# EAGLE design s2k_vr (EAGLE 7.6.0)
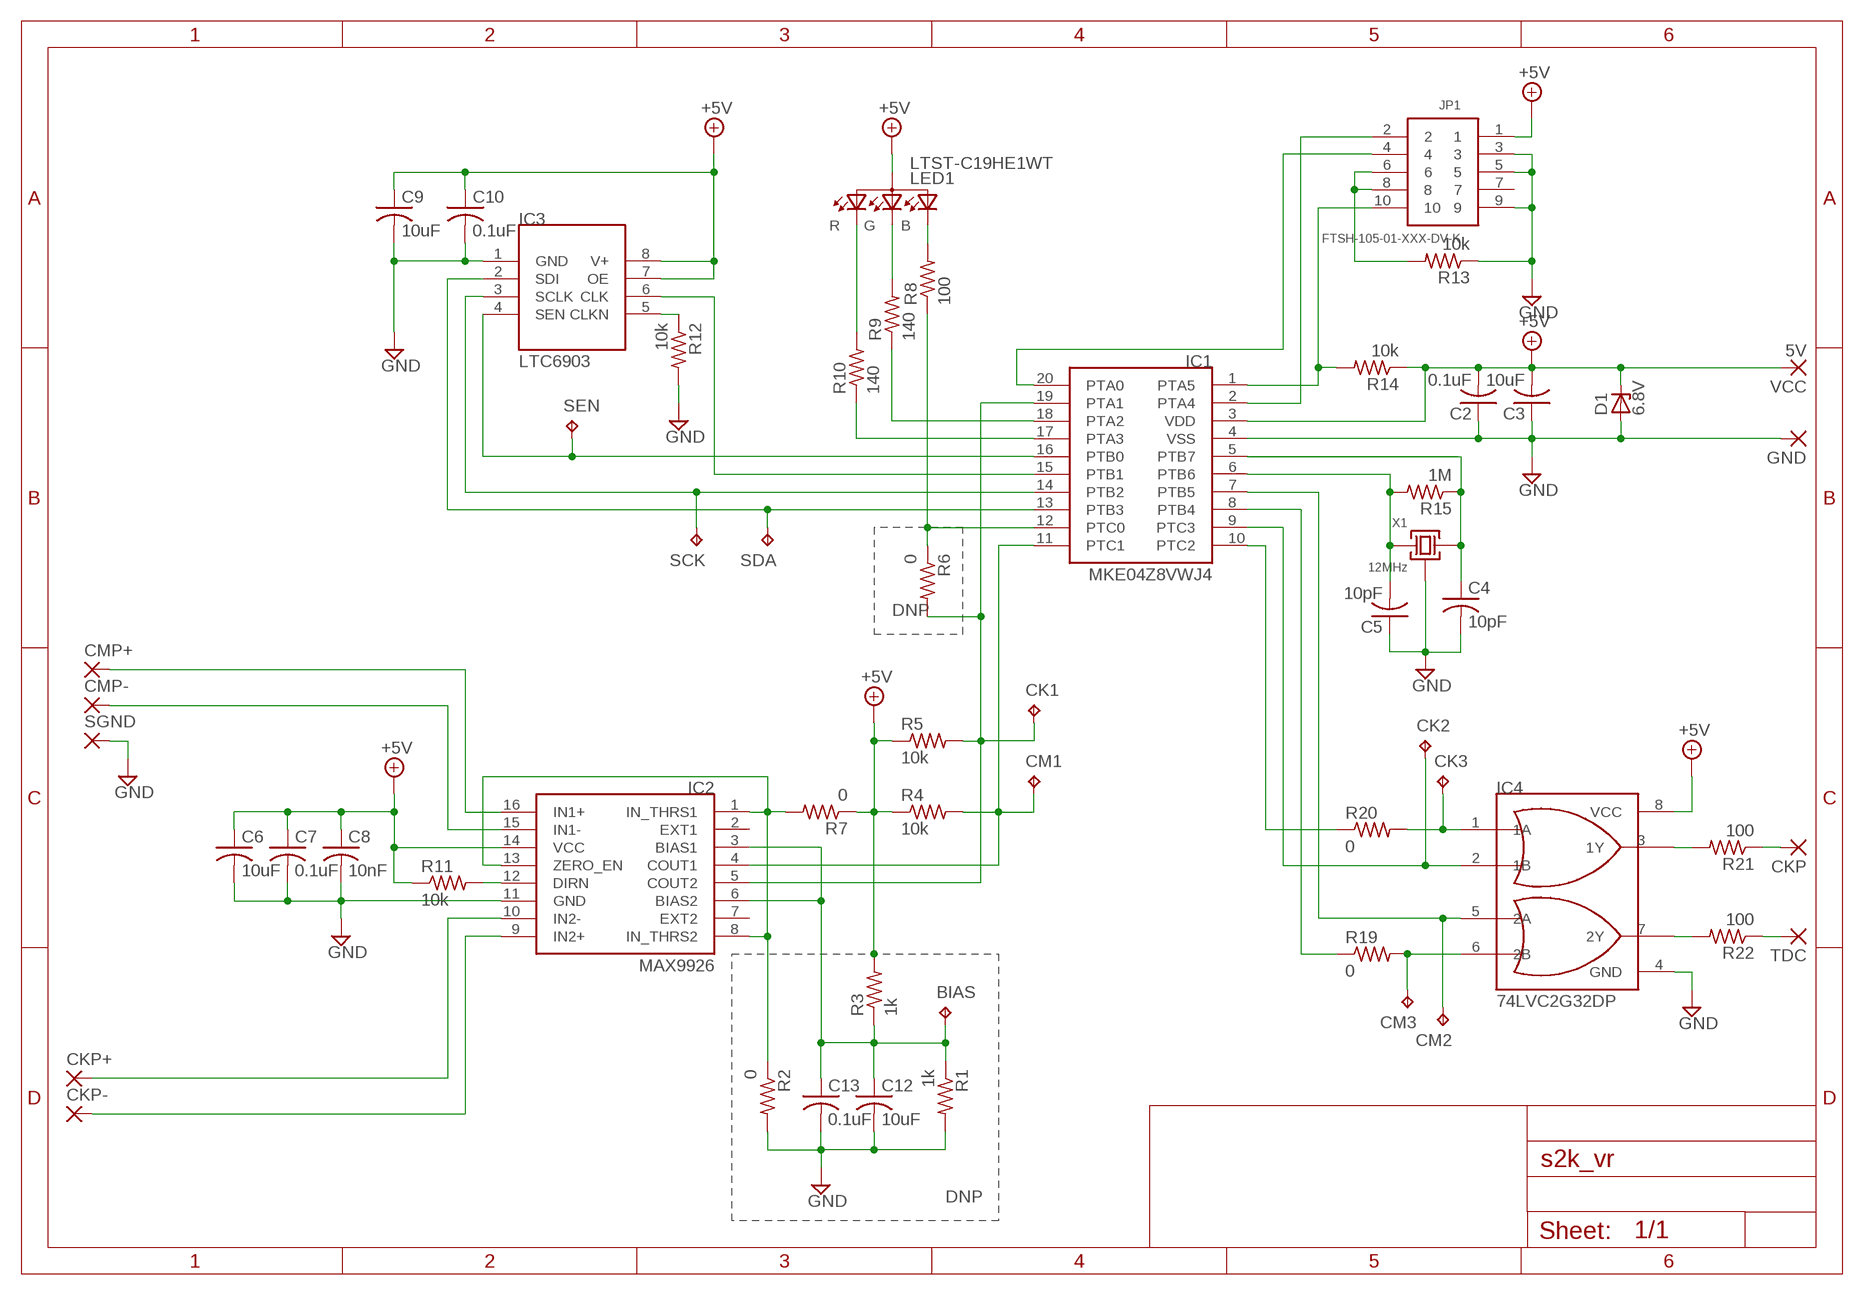
[diagram p0: schematic, sheet 1]

## Parts
BIAS  TPB2,54  [B2,54]
C2  0.1uF  C-USC0603  [C0603]
C3  10uF  C-USC0805  [C0805]
C4  10pF  C-USC0603  [C0603]
C5  10pF  C-USC0603  [C0603]
C6  10uF  C-USC0805  [C0805]
C7  0.1uF  C-USC0603  [C0603]
C8  10nF  CAP-0306  [C0306]
C9  10uF  C-USC0805  [C0805]
C10  0.1uF  C-USC0603  [C0603]
C12  10uF  C-USC0603  [C0603]
C13  0.1uF  C-USC0603  [C0603]
CK1  TPB2,54  [B2,54]
CK2  TPB2,54  [B2,54]
CK3  TPB2,54  [B2,54]
CKP  3,81/1,4  [3,81/1,4]
CKP+  3,81/1,4  [3,81/1,4]
CKP-  3,81/1,4  [3,81/1,4]
CM1  TPB2,54  [B2,54]
CM2  TPB2,54  [B2,54]
CM3  TPB2,54  [B2,54]
CMP+  3,81/1,4  [3,81/1,4]
CMP-  3,81/1,4  [3,81/1,4]
D1  6.8V  ZENER-DIODESOT23  [SOT23]
GND  3,81/1,4  [3,81/1,4]
IC1  MKE04Z8VWJ4  [SOIC20S]
IC2  MAX9926  [16-QSOP]
IC3  LTC6903  [MS8]
IC4  74LVC2G32DP  [TSSOP8]
JP1  FTSH-105-01-XXX-DV-K  [FTSH-105-01-XXX-DV-K]
LED1  LTST-C19HE1WT  [LED-0606]
R1  1k  R-US_R0603  [R0603]
R2  0  R-US_R0603  [R0603]
R3  1k  R-US_R0603  [R0603]
R4  10k  R-US_R0603  [R0603]
R5  10k  R-US_R0603  [R0603]
R6  0  R-US_R0603  [R0603]
R7  0  R-US_R0603  [R0603]
R8  100  R-US_R0603  [R0603]
R9  140  R-US_R0603  [R0603]
R10  140  R-US_R0603  [R0603]
R11  10k  R-US_R0603  [R0603]
R12  10k  R-US_R0603  [R0603]
R13  10k  R-US_R0603  [R0603]
R14  10k  R-US_R0603  [R0603]
R15  1M  R-US_R0603  [R0603]
R19  0  R-US_R0603  [R0603]
R20  0  R-US_R0603  [R0603]
R21  100  R-US_R0603  [R0603]
R22  100  R-US_R0603  [R0603]
SCK  TPB2,54  [B2,54]
SDA  TPB2,54  [B2,54]
SEN  TPB2,54  [B2,54]
SGND  3,81/1,4  [3,81/1,4]
TDC  3,81/1,4  [3,81/1,4]
VCC  5V  3,81/1,4  [3,81/1,4]
X1  12MHz  CX2520DB  [SMD4-2520]

## Nets
+5V: C2.2 C3.2 C6.1 C7.1 C8.1 C9.1 C10.1 D1.3(C) IC1.3(VDD) IC2.14(VCC) IC3.7(OE) IC3.8(V+) IC4.8(VCC) JP1.1 LED1.4(ANODE) R3.2 R4.1 R5.1 R7.1 R11.1 R14.1 VCC.1(P)
CAM_EDGE: CM1.TP IC1.11(PTC1) IC2.4(COUT1) R4.2
CAM_IN+: CKP+.1(P) IC2.10(IN2-)
CAM_IN-: CKP-.1(P) IC2.9(IN2+)
CAM_OUT: R22.1 TDC.1(P)
CAM_PULSE: CK2.TP IC1.9(PTC3) IC4.2(1B)
CAM_TDC: CK3.TP IC4.1(1A) R20.2
CLK: IC1.15(PTB1) IC3.6(CLK)
CRANK_EDGE: CK1.TP IC1.19(PTA1) IC2.5(COUT2) R5.2 R6.2
CRANK_IN+: CMP+.1(P) IC2.16(IN1+)
CRANK_IN-: CMP-.1(P) IC2.15(IN1-)
CRANK_OUT: CKP.1(P) R21.1
CRANK_PULSE: CM2.TP IC1.7(PTB5) IC4.5(2A)
GND: C2.1 C3.1 C4.2 C5.1 C6.2 C7.2 C8.2 C9.2 C10.2 C12.2 C13.2 D1.1(A) GND.1(P) IC1.4(VSS) IC2.11(GND) IC3.1(GND) IC4.4(GND) JP1.3 JP1.5 JP1.9 R1.2 R2.2 R12.2 R13.1 SGND.1(P) X1.2(GND) X1.4(GND)
MOSI: IC1.13(PTB3) IC3.2(SDI) SDA.TP
N$5: IC2.12(DIRN) R11.2
N$6: IC1.18(PTA2) R9.1
N$9: LED1.3(B) R8.2
N$10: C4.1 IC1.5(PTB7) R15.1 X1.1
N$12: IC1.17(PTA3) R10.1
N$13: IC3.5(CLKN) R12.1
N$14: IC1.12(PTC0) R6.1 R8.1
N$15: IC1.8(PTB4) R19.1
N$17: IC1.10(PTC2) R20.1
N$19: BIAS.TP C12.1 C13.1 IC2.3(BIAS1) IC2.6(BIAS2) R1.1 R3.1
N$20: LED1.2(G) R9.2
N$21: IC4.3(1Y) R21.2
N$22: LED1.1(R) R10.2
N$24: JP1.6 JP1.8 R13.2
N$25: CM3.TP IC4.6(2B) R19.2
N$26: C5.2 IC1.6(PTB6) R15.2 X1.3
N$36: IC2.1(IN_THRS1) IC2.8(IN_THRS2) IC2.13(ZERO_EN) R2.1 R7.2
N$39: IC4.7(2Y) R22.2
NRST: IC1.1(PTA5) JP1.10 R14.2
SPICK: IC1.14(PTB2) IC3.3(SCLK) SCK.TP
SPIEN: IC1.16(PTB0) IC3.4(SEN) SEN.TP
SWCLK: IC1.20(PTA0) JP1.4
SWDIO: IC1.2(PTA4) JP1.2
Unconnected: IC2.2(EXT1) IC2.7(EXT2) JP1.7

## Notes on the sheet
- DNP
- DNP

## Library data of the parts
BIAS CK1-CK3 CM1-CM3 SCK SDA SEN = testpad:TP: Test pad
C2-C7 C9 C10 = resistor:C-US: CAPACITOR, American symbol
C8 = parts:CAP-0306
C12 C13 = resistor:C-US: CAPACITOR, American symbol; DNP: DNP
CKP CKP+ CKP- CMP+ CMP- GND SGND TDC VCC = wirepad:3,81/1,4: THROUGH-HOLE PAD
D1 = diode:ZENER-DIODE: Z-Diode
IC1 = parts:MKE04Z8VWJ4
IC2 = parts:MAX9926
IC3 = parts:LTC6903
IC4 = parts:74LVC2G32DP
JP1 = FTSH-105-XX-XX-DV-K:FTSH-105-01-XXX-DV-K
LED1 = parts:LTST-C19HE1WT
R1-R3 R6 = resistor:R-US_: RESISTOR, American symbol; DNP: DNP
R4 R5 R7-R15 R19-R22 = resistor:R-US_: RESISTOR, American symbol
X1 = parts:CX2520DB

## Board
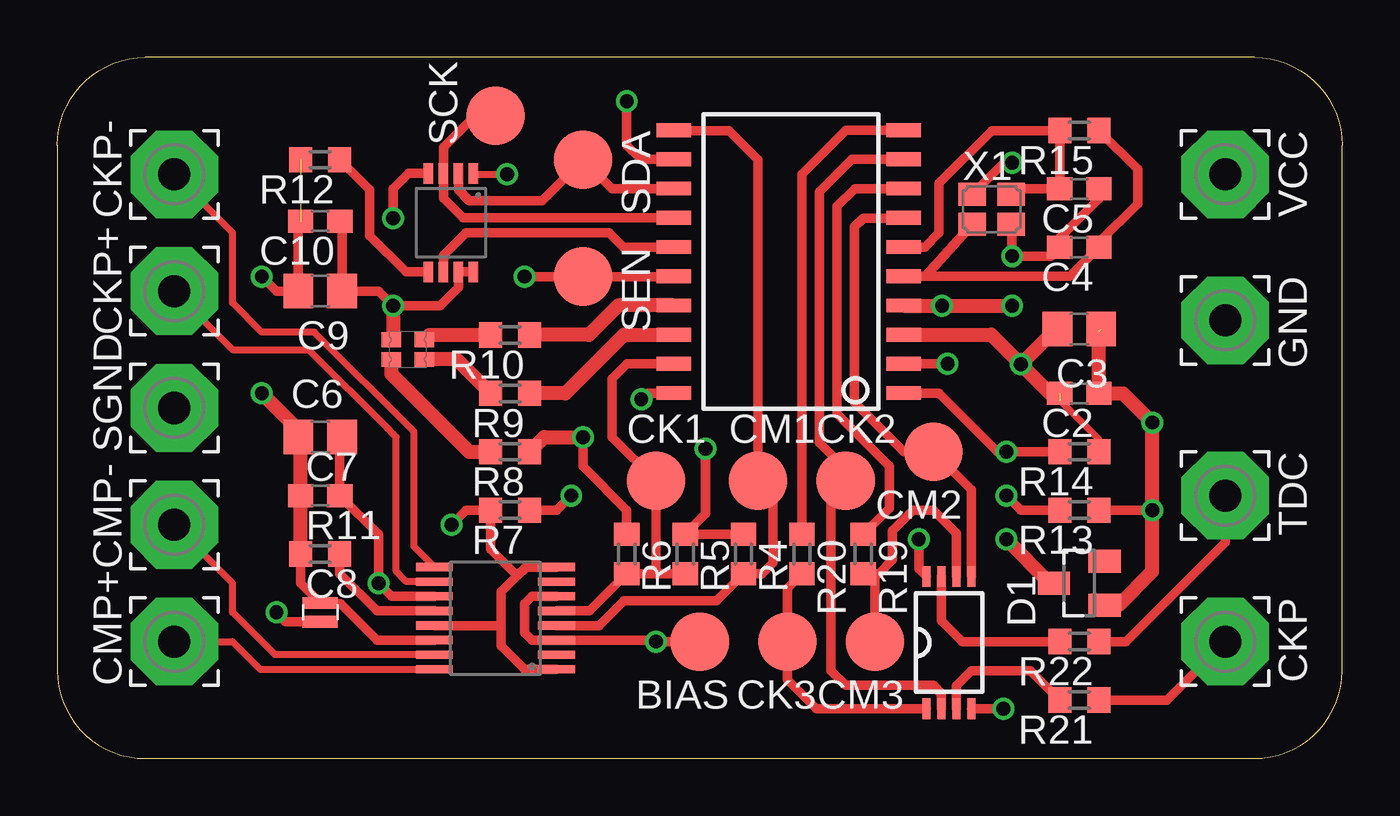
[diagram p1: board, top side]
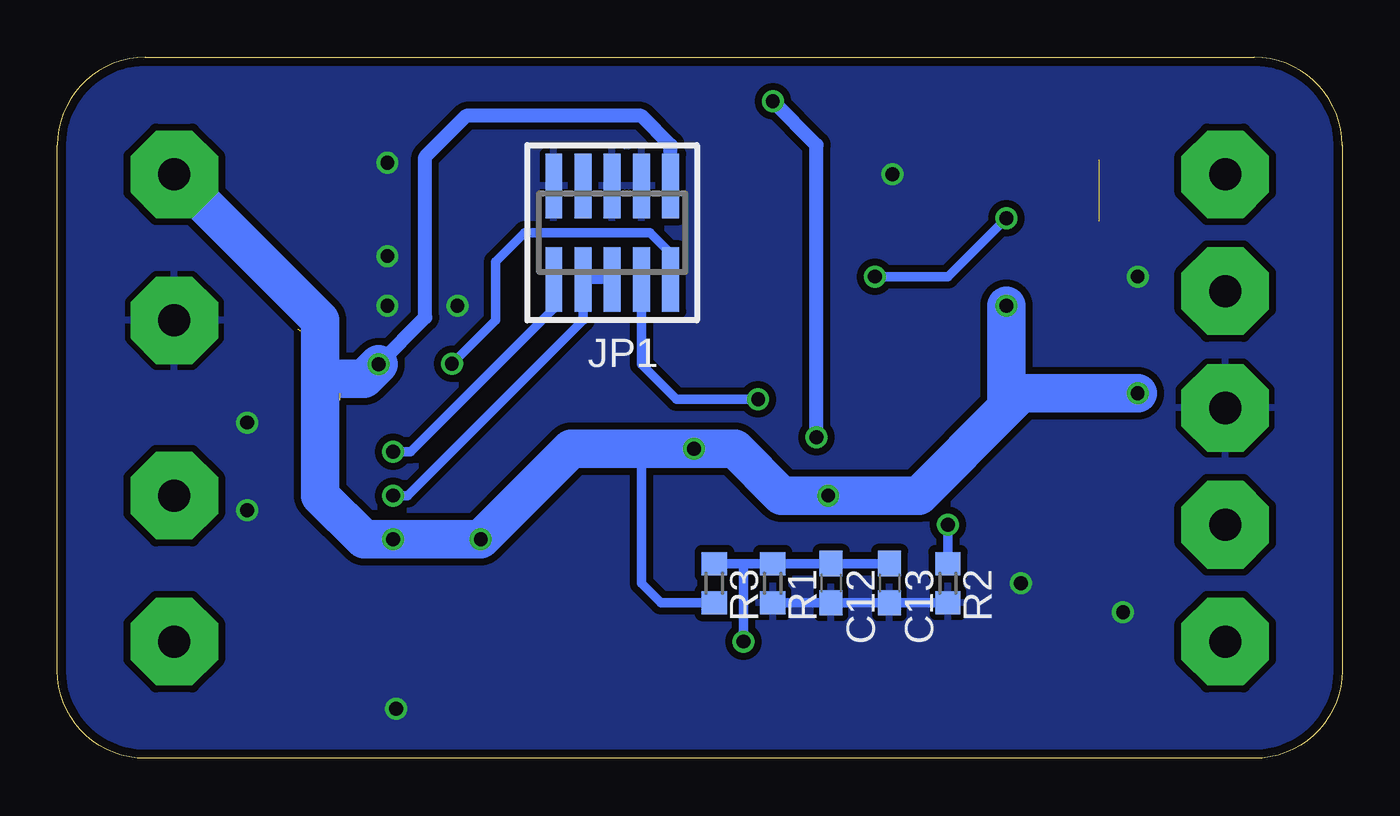
[diagram p2: board, bottom side, seen from below]

Size 55.88 x 30.48 mm. Coordinates in mm from the lower left corner, seen from the top.
Outline: 3.81,0 52.07,0 arc90 55.88,3.81 55.88,26.67 arc90 52.07,30.48 3.81,30.48 arc90 0,26.67 0,3.81 arc90 3.81,0
Copper layers (1*16): Top 0.0356mm / dielectric 1.5011mm / Bottom 0.0356mm
Design rules "oshpark-2layer *": minimum track width 6mil, minimum drill 13mil, track to track 6mil, track to pad 6mil, pad to pad 6mil, via to via 6mil, smd to smd 6mil, copper to edge 15mil, drill to drill 6mil, minimum pad ring 7mil, minimum via ring 7mil, stop-mask expansion 2.5mil, vias tented up to drill 0mil, thermal gap 10mil

### Footprints (pad centres in the part's own frame; a part is rotated, then mirrored left to right if it is on the bottom)
B2,54 = smd 2.54 x 2.54: TP 0,0
C0603 = smd 1.1 x 1: 1 -0.85,0; 2 0.85,0
C0805 = smd 1.3 x 1.5: 1 -0.95,0; 2 0.95,0
C0306 = smd 1.52 x 0.51: 1 0,0.41; 2 0,-0.41
3,81/1,4 = drill 1.397 pad 3.81 octagon: 1 0,0
SOT23 = smd 1 x 1.4: 1 -0.95,-1.1; 2 0.95,-1.1; 3 0,1.1
SOIC20S = smd 0.6 x 1.5: 1 -5.715,-5; 2 -4.445,-5; 3 -3.175,-5; 4 -1.905,-5; 5 -0.635,-5; 6 0.635,-5; 7 1.905,-5; 8 3.175,-5; 9 4.445,-5; 10 5.715,-5; 11 5.715,5; 12 4.445,5; 13 3.175,5; 14 1.905,5; 15 0.635,5; 16 -0.635,5; 17 -1.905,5; 18 -3.175,5; 19 -4.445,5; 20 -5.715,5
16-QSOP = smd 1.6 x 0.36: 1 -2.655,2.223; 2 -2.655,1.587; 3 -2.655,0.953; 4 -2.655,0.318; 5 -2.655,-0.318; 6 -2.655,-0.953; 7 -2.655,-1.587; 8 -2.655,-2.223; 9 2.655,-2.223; 10 2.655,-1.587; 11 2.655,-0.953; 12 2.655,-0.318; 13 2.655,0.318; 14 2.655,0.953; 15 2.655,1.587; 16 2.655,2.223
MS8 = smd 0.419 x 0.889: 1 -0.975,-2.14; 2 -0.325,-2.14; 3 0.325,-2.14; 4 0.975,-2.14; 5 0.975,2.14; 6 0.325,2.14; 7 -0.325,2.14; 8 -0.975,2.14
TSSOP8 = smd 0.9 x 0.35: 1 -2.875,0.975; 2 -2.875,0.325; 3 -2.875,-0.325; 4 -2.875,-0.975; 5 2.875,-0.975; 6 2.875,-0.325; 7 2.875,0.325; 8 2.875,0.975
FTSH-105-01-XXX-DV-K = smd 0.737 x 2.794: 1 -2.54,-2.032; 2 -2.54,2.032; 3 -1.27,-2.032; 4 -1.27,2.032; 5 0,-2.032; 6 0,2.032; 7 1.27,-2.032; 8 1.27,2.032; 9 2.54,-2.032; 10 2.54,2.032
LED-0606 = smd 0.635 x 0.85: 1 -0.425,0.725; 2 0.425,0.725; 3 0.425,-0.725; 4 -0.425,-0.725
R0603 = smd 1 x 1.1: 1 -0.85,0; 2 0.85,0
SMD4-2520 = smd 1.2 x 1: 1 -0.85,-0.65; 2 0.85,-0.65; 3 0.85,0.65; 4 -0.85,0.65

### Placement (x,y rotation side)
BIAS  27.94,5.08 180 top
C2  44.45,15.88 180 top
C3  44.45,18.67 180 top
C4  44.45,22.23 180 top
C5  44.45,24.77 180 top
C6  11.43,13.97 0 top
C7  11.43,11.43 0 top
C8  11.43,6.35 0 top
C9  11.43,20.32 180 top
C10  11.43,23.37 180 top
C12  22.23,7.62 270 bottom
C13  19.68,7.62 270 bottom
CK1  26.04,12.06 0 top
CK2  34.29,12.06 0 top
CK3  31.75,5.08 180 top
CKP  50.8,5.08 270 top
CKP+  5.08,20.32 90 top
CKP-  5.08,25.4 90 top
CM1  30.48,12.06 0 top
CM2  38.1,13.34 180 top
CM3  35.56,5.08 180 top
CMP+  5.08,5.08 90 top
CMP-  5.08,10.16 90 top
D1  44.45,7.62 90 top
GND  50.8,19.05 270 top
IC1  31.81,21.6 90 top
IC2  19.05,6.1 180 top
IC3  17.12,23.3 180 top
IC4  38.78,5.04 90 top
JP1  31.75,22.86 180 bottom
LED1  15.24,17.78 270 top
R1  24.77,7.62 270 bottom
R2  17.14,7.62 270 bottom
R3  27.3,7.62 270 bottom
R4  29.84,8.89 270 top
R5  27.3,8.89 270 top
R6  24.77,8.89 270 top
R7  19.68,10.79 180 top
R8  19.68,13.34 180 top
R9  19.68,15.88 180 top
R10  19.68,18.41 180 top
R11  11.43,8.89 0 top
R12  11.43,26.04 180 top
R13  44.45,10.79 180 top
R14  44.45,13.34 180 top
R15  44.45,27.3 180 top
R19  35.05,8.89 270 top
R20  32.38,8.89 270 top
R21  44.45,2.54 180 top
R22  44.45,5.08 180 top
SCK  19.05,27.94 90 top
SDA  22.86,26.04 270 top
SEN  22.86,20.95 270 top
SGND  5.08,15.24 90 top
TDC  50.8,11.43 270 top
VCC  50.8,25.4 270 top
X1  40.64,23.88 0 top

### Tracks (layer width: path | path; a pad name or v marks a point on that pad's centre or on a via)
+5V  (via drill 0.6)  (1 unrouted)
  Top 0.305: IC1.3 36.82,18.41 | R14.1 45.3,13.88 43.6,15.58
  Top 0.406: C10.1 12.38,23.27 C9.1 13.97,20.32 v14.61,19.68 16.64,19.68 17.44,20.49 IC3.7 IC3.8 | R7.1 21.72,10.79 v22.35,11.43 | R4.1 R5.1 28.19,10.63 v28.19,13.46 | 43.18,15.88 C2.2 | 43.43,18.67 C3.2 | IC2.14 13.91,5.14 12.32,6.73 11.46,6.73 C8.1 10.58,7.61 R11.1 | IC4.8 37.47,8.26 v37.47,9.53
  Top 0.61: v14.61,19.68 14.61,18.3 LED1.4 | C3.2 43.25,18.41 | IC1.3 40.63,18.43 v41.91,17.14 | v41.91,17.14 43.18,15.88 | v41.91,17.14 43.43,18.67 | R11.1 C7.1 10.58,13.87 C6.1 10.48,14.29 v8.89,15.88 | D1.3 43.18,7.62 v41.27,9.53
  Bottom 0.406: R3.2 29.63,6.77 30.48,7.62 30.48,13.46
  Bottom 0.61: JP1.1 29.21,26.67 30.48,27.94 38.1,27.94 39.88,26.16 39.88,19.18 v41.91,17.14
  Bottom 1.676: 14.61,15.24 18.41,11.43 v22.35,11.43 24.38,11.43 26.42,13.46 v28.19,13.46 30.48,13.46 33.53,13.46 v37.47,9.53 v41.27,9.53 42.55,9.53 44.45,11.43 44.45,16.51 | 14.61,15.24 v14.61,19.68 | 44.45,16.51 44.45,19.05 VCC.1 | v41.91,17.14 42.55,16.51 44.45,16.51 | v8.89,15.88 13.97,15.88 14.61,15.24
CAM_EDGE
  Top 0.305: 26.82,27.3 IC1.11
  Top 0.406: 26.82,27.3 29.21,27.3 30.48,26.04 CM1.TP 31.11,11.43 31.11,8.51 30.65,8.04 R4.2 28.66,6.86 24.64,6.86 23.56,5.78 IC2.4
CAM_IN+
  Top 0.305: IC2.10 15.18,7.68 14.73,8.13 14.73,13.97 14.61,14.1 14.35,14.35 10.92,17.78 7.62,17.78 CKP+.1
CAM_IN-
  Top 0.305: CKP-.1 7.62,22.86 7.62,19.81 8.89,18.54 11.18,18.54 15.49,14.22 15.49,9.22 IC2.9
CAM_OUT
  Top 0.406: R22.1 46.48,5.08 50.8,9.4 TDC.1
CAM_PULSE
  Top 0.406: IC1.9 35.56,26.05 34.94,26.05 34.56,26.05 33.15,24.64 33.15,13.72 34.29,12.57 CK2.TP 33.66,11.43 33.66,3.81 34.29,3.17 38.1,3.17 38.46,2.82 IC4.2
CAM_TDC
  Top 0.406: R20.2 31.75,7.41 CK3.TP 31.75,3.43 33.02,2.16 IC4.1
CLK
  Top 0.406: IC3.6 16.79,21.87 17.78,22.86 24,22.86 24.62,22.24 IC1.15
CRANK_EDGE
  Top 0.305: 26.04,8.17 26.16,8.04
  Top 0.406: IC1.19 24.78,17.16 24.13,16.51 24.13,13.97 CK1.TP 26.04,8.17 | IC2.5 23.14,6.41 R6.2 26.16,8.04 R5.2
CRANK_IN+
  Top 0.305: CMP+.1 7.62,5.08 8.83,3.87 IC2.16
CRANK_IN-
  Top 0.305: IC2.15 9.46,4.51 7.62,6.35 7.62,7.62 CMP-.1
CRANK_OUT
  Top 0.406: R21.1 48.26,2.54 CKP.1
CRANK_PULSE
  Top 0.305: 36.79,23.5 IC1.7
  Top 0.406: 36.79,23.5 35.05,23.5 34.67,23.11 34.67,15.49 36.83,13.34 CM2.TP 39.76,11.68 IC4.5
GND  (via drill 0.6)  (2 unrouted)
  Top 0.305: IC3.1 18.13,25.4 v19.56,25.4 | X1.2 41.53,23.21 | 43.22,21.84 C4.2 43.6,22.64 | C5.1 45.3,24.34 | IC1.4 36.82,19.68
  Top 0.406: C8.2 9.94,5.94 v9.53,6.35 | IC2.11 14.54,7.05 v13.97,7.62 13.97,9.74 C7.2 12.28,13.87 C6.2 | C10.2 10.48,23.27 C9.2 9.53,20.32 v8.89,20.95 | 41.53,23.21 v41.53,21.84 43.22,21.84 | 45.3,24.34 43.6,22.64 | IC4.4 v41.15,2.16 | v47.62,10.79 47.62,10.67 47.5,10.79 R13.1 | X1.4 41.17,25.91 v41.53,25.91
  Top 0.61: 45.3,18.57 C2.1 46.35,15.88 v47.62,14.61 v47.62,10.79 47.62,8.13 46.17,6.67 D1.1 | 36.82,19.68 v38.48,19.68 v41.53,19.68
  Bottom 0.406: R1.2 C12.2 C13.2 R2.2
  pour Bottom (isolate 0.305): 0.13,26.67 arc-90 3.81,30.35 52.07,30.35 arc-90 55.75,26.67 55.75,3.81 arc-90 52.07,0.13 3.81,0.13 arc-90 0.13,3.81
MOSI
  Top 0.406: IC1.13 24.12,24.78 SDA.TP 21.08,24.26 17.91,24.26 17.44,24.72 IC3.2
N$5
  Top 0.406: IC2.12 13.91,6.41 12.28,8.04 R11.2
N$6
  Top 0.61: R9.1 22.1,15.88 24.65,18.43 IC1.18
N$9
  Top 0.406: 18.54,13.34 R8.2
  Top 0.61: LED1.3 14.52,16.73 17.91,13.34 R8.2
N$10
  Top 0.305: 45.3,22.44 C4.1
  Top 0.406: IC1.5 37.76,20.97 | 37.76,20.97 X1.1 | C4.1 44.04,20.97 37.76,20.97 | R15.1 46.99,25.61 46.99,24.13 45.3,22.44
N$12
  Top 0.61: IC1.17 24.4,19.7 23.11,18.41 R10.1
N$13
  Top 0.406: R12.1 13.59,24.73 13.59,22.73 15.16,21.16 IC3.5
N$14  (via drill 0.6)
  Top 0.406: R6.1 24.77,10.79 22.86,12.7 v22.86,13.97 | v24.77,28.57 24.77,26.67 25.39,26.05 IC1.12
  Top 0.61: R8.1 21.17,13.97 v22.86,13.97
  Bottom 0.61: v22.86,13.97 22.86,26.67 v24.77,28.57
N$15
  Top 0.406: IC1.8 34.69,24.78 33.91,24 33.91,14.99 36.2,12.7 36.2,10.88 R19.1
N$17
  Top 0.305: 36.79,27.3 IC1.10
  Top 0.406: IC1.10 34.3,27.32 32.38,25.4 R20.1
N$19  (via drill 0.6)
  Top 0.406: IC2.6 20.64,7.05 20.32,6.73 20.32,5.46 20.64,5.14 IC2.3 25.97,5.14 v26.04,5.08 BIAS.TP
  Bottom 0.406: C13.1 C12.1 R1.1 26.16,8.47 | R3.1 26.16,8.47 | v26.04,5.08 26.04,8.34 26.16,8.47
N$20
  Top 0.61: R9.2 17.36,17.36 LED1.2
N$21
  Top 0.406: R21.2 42.33,3.81 39.75,3.81 39.11,3.17 IC4.3
N$22
  Top 0.406: LED1.1 16.18,18.41
  Top 0.61: 16.18,18.41 R10.2
N$24  (via drill 0.6)
  Top 0.406: R13.2 41.91,10.79 v41.27,11.43
  Bottom 0.406: JP1.6 JP1.8 33.02,19.05 40.64,11.43 v41.27,11.43
N$25
  Top 0.406: IC4.6 39.11,9.79 38.1,10.79 37.21,10.79 36.32,9.91 36.32,8.64 35.73,8.04 35.56,8.04 | 35.56,8.04 R19.2 | CM3.TP 35.56,8.04
N$26
  Top 0.305: X1.3 41.75,24.77
  Top 0.406: IC1.6 37.73,22.24 38.35,22.86 38.35,25.02 40.64,27.3 R15.2 C5.2 41.75,24.77
N$36  (via drill 0.6)
  Top 0.406: IC2.1 20.32,3.87 19.3,4.89 19.3,5.71 | IC2.8 20.38,8.32 20,7.94 | 20,7.94 19.3,7.24 19.3,5.71 | v17.14,10.16 17.78,10.79 R7.2 18.84,9.11 20,7.94 | IC2.13 19.24,5.78 19.3,5.71
  Bottom 0.406: R2.1 v17.14,10.16
N$39
  Top 0.406: R22.2 39.37,5.08 38.46,5.99 IC4.7
NRST  (via drill 0.6)
  Top 0.305: v41.27,13.34 40.89,13.34
  Top 0.406: IC1.1 38.34,15.89 40.89,13.34 | R14.2 v41.27,13.34
  Bottom 0.305: JP1.10 34.29,20.32
  Bottom 0.406: 34.29,20.32 34.29,20.11 34.29,19.56 40.51,13.34 v41.27,13.34
SPICK
  Top 0.305: 18.16,27.94 SCK.TP
  Top 0.406: IC1.14 17.64,23.51 16.79,24.36 IC3.3 16.79,26.57 18.16,27.94
SPIEN  (via drill 0.6)
  Top 0.406: IC1.16 26.79,20.95 SEN.TP v20.32,20.95 | v14.61,23.5 14.61,24.77 15.28,25.44 IC3.4
  Bottom 0.406: v20.32,20.95 17.14,20.95 v14.61,23.5
SWCLK  (via drill 0.6)
  Top 0.406: IC1.20 25.67,15.89 v25.4,15.62
  Bottom 0.406: JP1.4 30.48,17.14 28.96,15.62 v25.4,15.62
SWDIO  (via drill 0.6)
  Top 0.406: IC1.2 v38.72,17.16
  Bottom 0.305: 29.21,21.97 JP1.2
  Bottom 0.406: 29.21,21.97 30.1,22.86 35.56,22.86 36.83,21.59 36.83,19.05 v38.72,17.16

### Text on the board
tRestrict: S2k VR Converter